# Altium schematic sheet Servo_Power_Supply.SchDoc
size A4; SheetNumber: 7; SheetTotal: 18
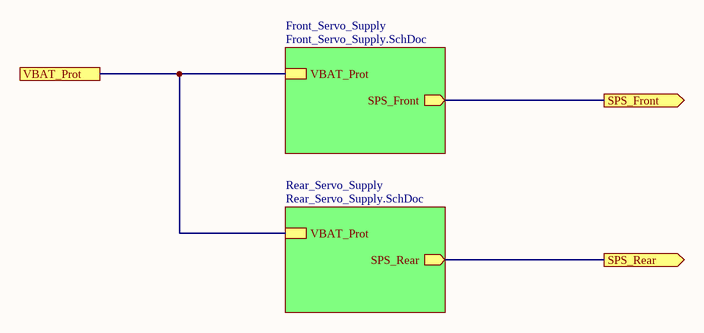
[diagram p0: Servo_Power_Supply.SchDoc]

## Sub-sheets
Front_Servo_Supply = Front_Servo_Supply.SchDoc: VBAT_Prot, SPS_Front (out)
Rear_Servo_Supply = Rear_Servo_Supply.SchDoc: VBAT_Prot, SPS_Rear (out)

## Ports
SPS_Front (out), SPS_Rear (out), VBAT_Prot

## Nets
SPS_Front: port SPS_Front, sheet Front_Servo_Supply/SPS_Front
SPS_Rear: port SPS_Rear, sheet Rear_Servo_Supply/SPS_Rear
VBAT_Prot: port VBAT_Prot, sheet Front_Servo_Supply/VBAT_Prot, sheet Rear_Servo_Supply/VBAT_Prot